# Altium schematic sheet Vapeix_mini_power.SchDoc: Vapeix Mini PCB - Power Supply
size A3; DrawnBy: Anne Moller; Organization: Altium Limited; Address1: L3, 12a Rodborough Rd; Address2: Frenchs Forest; Address3: NSW; Address4: Australia 2086
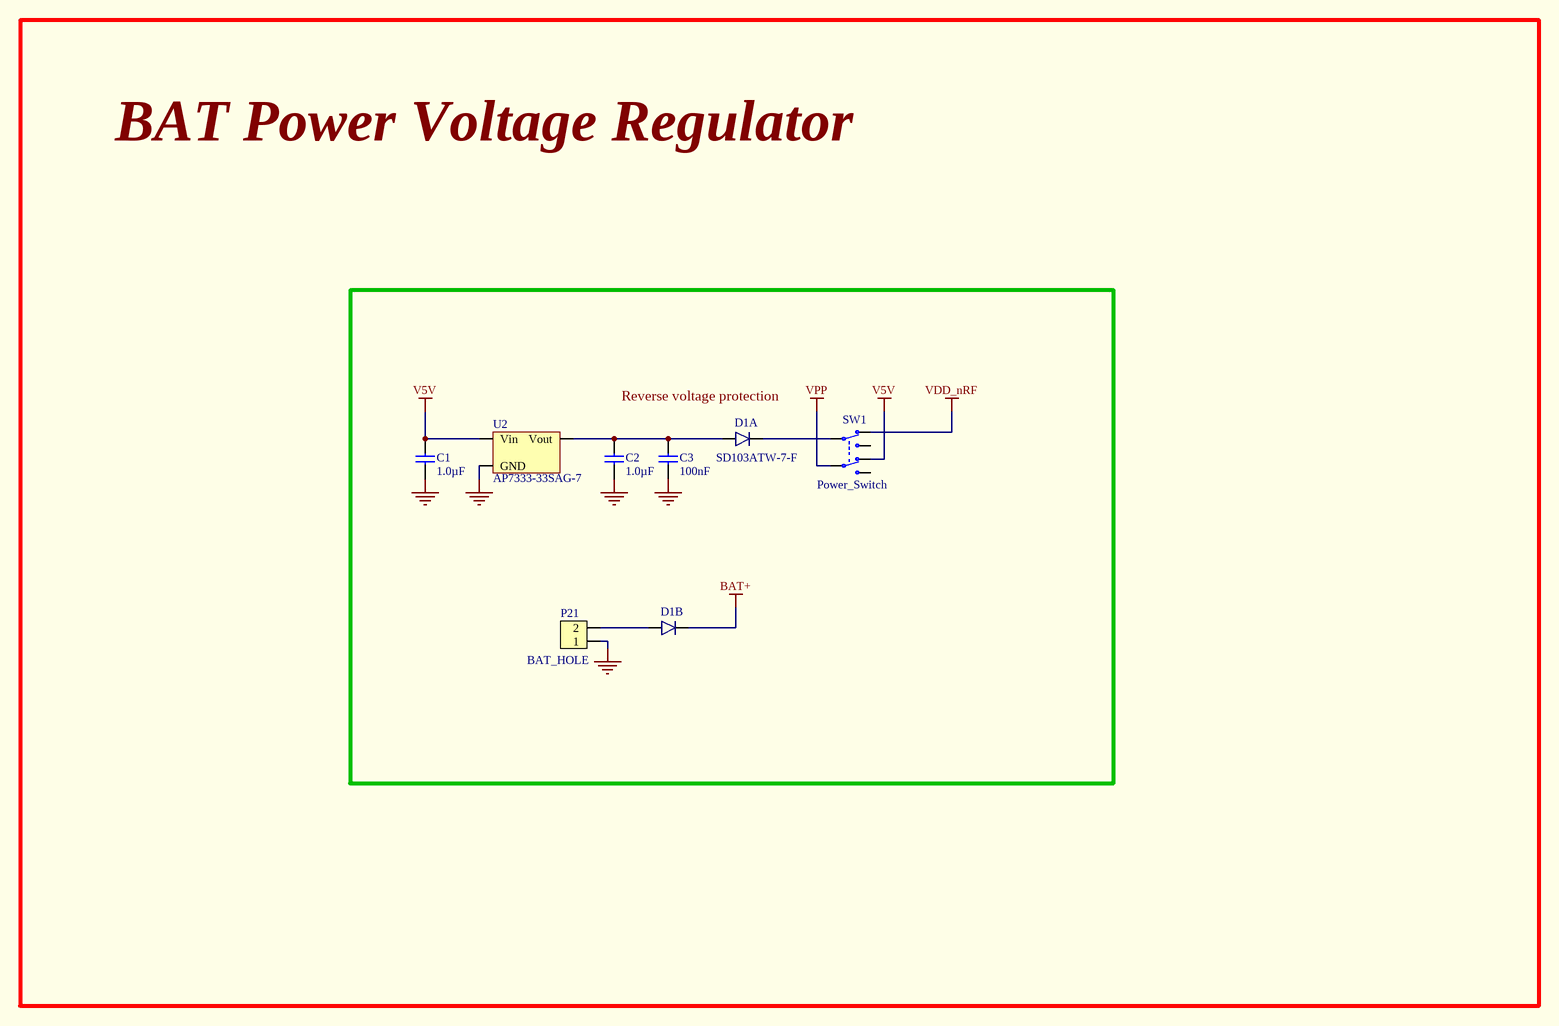
[diagram p0: Vapeix_mini_power.SchDoc]

## Parts
C1  1.0µF  [CAPC1608X06L]
C2  1.0µF  [CAPC1608X06L]
C3  100nF  [CAPC1005X04L]
D1  SD103ATW-7-F  [SOT-363]  (parts A,B of 3)
P21  BAT_HOLE  [LIST_ANG_1x2-SMD-2.54MM]
SW1  Power_Switch  [JS202011SCQN]
U2  AP7333-33SAG-7  [SOT-23A]

## Blocks framed on the sheet
Reverse voltage protection: C1-C3 D1 P21 SW1 U2

## Nets
BAT+: D1.2(C2)
GND: C1.1 C2.1 C3.1 P21.1 U2.3(GND)
V5V: C1.2 SW1.6(N.C-2) U2.1(Vin)
VDD_nRF: SW1.3(N.C-1)
VPP: SW1.5(COM-2)
NetC2_2: C2.2 C3.2 D1.6(A1) U2.2(Vout)
NetD1_1: D1.1(C1) SW1.2(COM-1)
NetD1_5: D1.5(A2) P21.2

Not connected (* = marked no-connect by the designer): SW1 1(N.O-1) 4(N.O-2)

## Notes on the sheet
- Labels drawn without touching a wire or pin: BAT Power Voltage Regulator
- Title
- Size:
- Date:
- A3
- Number:
- Time:
- Revision:
- Sheet
- of
- Drawn by:
- File:

## Library data of the parts
C1 C2 = C0603-1µ0: Capacitor, X7R, ±10%; Note: 16V; Artikkelnr Noca: 20039335; Artikkelnr Simpro: N.A.; Published: 2009-05-08; LatestRevisionDate: 2013-06-05; Publisher: Nordic Semiconductor; Value: 1.0µF; Part Number: C0603-1µ0; Manufacturer: *; Manufacturer Part Number: *; Datasheet: *; Pin Count: 2; Supplier: *; Supplier part number: *; 2nd source Supplier: *; 2nd source part number: *; Footprint Doc: 0603
C3 = C0402-100n: Capacitor, X7R, ±10%; Note: 16V; Artikkelnr Noca: 20039200; Artikkelnr Simpro: N.A.; Published: 2009-05-08; LatestRevisionDate: 2009-11-23; Publisher: Nordic Semiconductor; Value: 100nF; Part Number: C0402-100n; Manufacturer: *; Manufacturer Part Number: *; Datasheet: *; Pin Count: 2; Supplier: *; Supplier part number: *; 2nd source Supplier: *; 2nd source part number: *; Footprint Doc: 0402
D1 = D:DIODE_3_IND: Surface Mount Schottky Barrier Diode Array; Manufacturer: Diodes Incorporated; 2nd source part number: 177-3507; Artikkelnr Noca: 10029109; Artikkelnr Simpro: N.A.; Part Number: SD103ATW-7-F; Manufacturer Part Number: SD103ATW-7-F; Datasheet: http://www.diodes.com/datasheets/ds30374.pdf; LatestRevisionDate: 2012-06-15; Publisher: Nordic Semiconductor; Published: 2012-06-15; Value: SD103ATW-7-F; Note: *; Supplier: Digi-Key; Supplier part number: SD103ATW-FDITR-ND; 2nd source Supplier: Farnell; Footprint Doc: SOT-363
P21 = Pin List Ang 1x2 SMD, 2.54mm: Pin List 1x2, 2.54mm (100mil), Right Angled, SMD; 2nd source part number: S1113E-02-ND; Artikkelnr Noca: N.A.; Part Number: Pin List Ang 1x2 SMD, 2.54mm; Manufacturer: *; Manufacturer Part Number: *; Datasheet: *; LatestRevisionDate: 2014-04-30; Pin Count: 2; Publisher: Nordic Semiconductor; Published: 2014-04-30; Value: BAT_HOLE; Note: *; Supplier: Samtec; Supplier part number: TSM-102-01-L-SH-A; 2nd source Supplier: Digi-Key; Footprint Doc: LIST_ANG_1x2-SMD-2.54MM; Artikkelnr Simpro: N.A.
SW1 = JS202011SCQN: SMD slide Switch (ON-ON); Manufacturer: C&K Components; 2nd source part number: 232-0019; Artikkelnr Noca: N.A.; Part Number: JS202011SCQN; Manufacturer Part Number: JS202011SCQN; Datasheet: http://www.ck-components.com/14398/js_14july11.pdf/; LatestRevisionDate: 2014-06-24; Pin Count: 6; Publisher: Nordic Semiconductor; Published: 2014-06-24; Value: Power_Switch; Note: *; Supplier: Digi-Key; Supplier part number: 401-2002-1-ND; 2nd source Supplier: Farnell; Footprint Doc: JS202011SCQN; Artikkelnr Simpro: N.A.
U2 = AP7333-33SAG-7: 300mA, Low Quiescent Current, Fast Transient Low Dropout Linear Regulator; Manufacturer: Diodes Incorporated; Artikkelnr Noca: 17039216; Artikkelnr Simpro: N.A.; Part Number: AP7333-33SAG-7; Manufacturer Part Number: AP7333-33SAG-7; Datasheet: http://www.diodes.com/datasheets/AP7333.pdf; LatestRevisionDate: 2012-06-15; Pin Count: 3; Publisher: Nordic Semiconductor; Published: 2012-06-15; Value: AP7333-33SAG-7; Note: *; Supplier: Digi-Key; Supplier part number: AP7333-33SAG-7DICT-ND; 2nd source Supplier: *; 2nd source part number: *; Footprint Doc: SOT-23-3